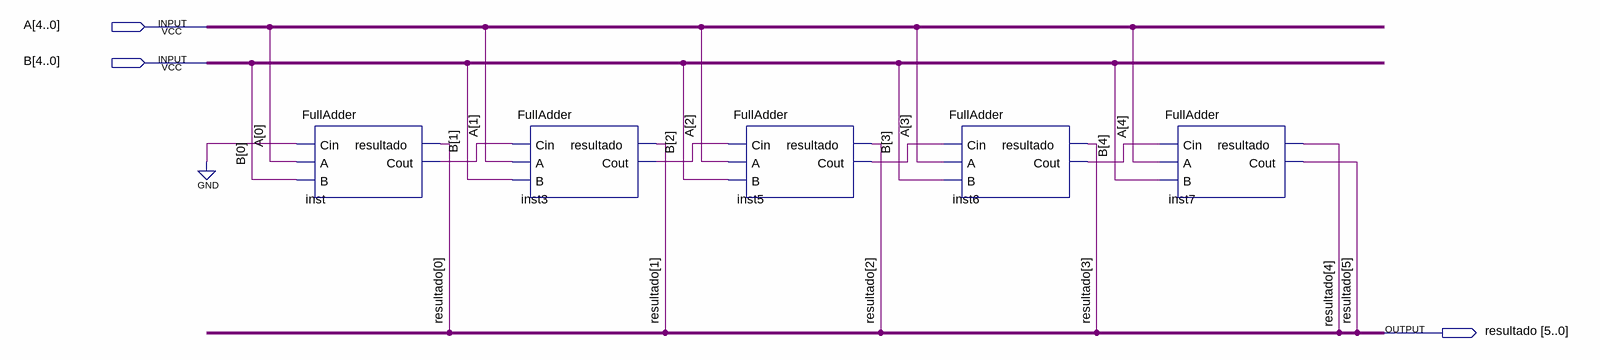
[diagram p0: schematic sheet]
// Quartus schematic Adder5bit.bdf as structural Verilog: 5 symbols, 3 pins
module Adder5bit (
  input  [4:0] A,
  input  [4:0] B,
  output [5:0] resultado
);

  wire inst3_cout, inst5_cout, inst6_cout, inst_cout;

  FullAdder inst (.Cin(1'b0), .A(A[0]), .B(B[0]), .resultado(resultado[0]), .Cout(inst_cout));
  FullAdder inst3 (.Cin(inst_cout), .A(A[1]), .B(B[1]), .resultado(resultado[1]), .Cout(inst3_cout));
  FullAdder inst5 (.Cin(inst3_cout), .A(A[2]), .B(B[2]), .resultado(resultado[2]), .Cout(inst5_cout));
  FullAdder inst6 (.Cin(inst5_cout), .A(A[3]), .B(B[3]), .resultado(resultado[3]), .Cout(inst6_cout));
  FullAdder inst7 (.Cin(inst6_cout), .A(A[4]), .B(B[4]), .resultado(resultado[4]), .Cout(resultado[5]));
endmodule
